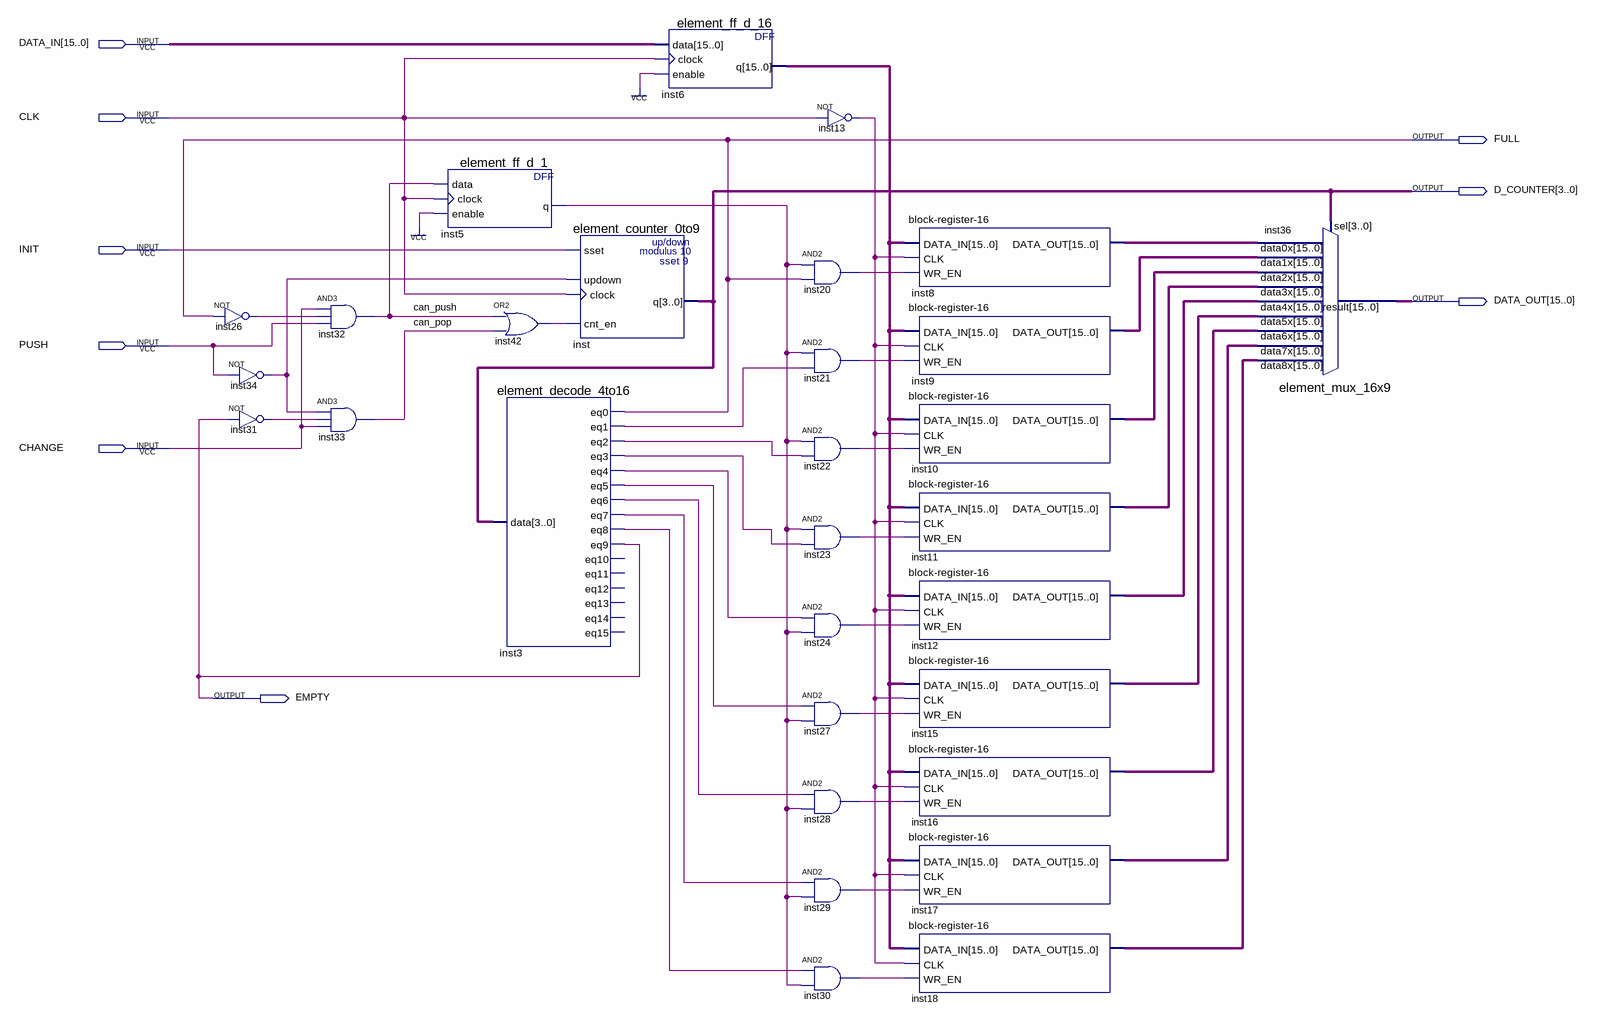
[diagram p0: schematic sheet]
// Quartus schematic block-stack.bdf as structural Verilog: 30 symbols, 9 pins
module \block-stack  (
  input  [15:0] DATA_IN,
  input  CLK,
  input  INIT,
  input  PUSH,
  input  CHANGE,
  output FULL,
  output [3:0] D_COUNTER,
  output [15:0] DATA_OUT,
  output EMPTY
);

  wire can_pop, can_push, inst3_eq1, inst3_eq2, inst3_eq3, inst3_eq4, inst3_eq5, inst3_eq6, inst3_eq7,
       inst3_eq8, inst5_q, inst13_out, inst20_out, inst21_out, inst22_out, inst23_out, inst24_out,
       inst26_out, inst27_out, inst28_out, inst29_out, inst30_out, inst31_out, inst34_out, inst42_out;
  wire [15:0] inst6_q, inst8_data_out, inst9_data_out, inst10_data_out, inst11_data_out, inst12_data_out,
       inst15_data_out, inst16_data_out, inst17_data_out, inst18_data_out;

  not inst26 (inst26_out, FULL);
  not inst34 (inst34_out, PUSH);
  not inst31 (inst31_out, EMPTY);
  and inst32 (can_push, CHANGE, inst26_out, PUSH);
  and inst33 (can_pop, inst34_out, inst31_out, CHANGE);
  element_ff_d_1 inst5 (.data(can_push), .clock(CLK), .enable(1'b1), .q(inst5_q));
  or inst42 (inst42_out, can_push, can_pop);
  element_decode_4to16 inst3 (
    .data(D_COUNTER), .eq0(FULL), .eq1(inst3_eq1), .eq2(inst3_eq2), .eq3(inst3_eq3), .eq4(inst3_eq4),
    .eq5(inst3_eq5), .eq6(inst3_eq6), .eq7(inst3_eq7), .eq8(inst3_eq8), .eq9(EMPTY));  // open: eq10, eq11, eq12, eq13, eq14, eq15
  element_counter_0to9 inst (.sset(INIT), .updown(inst34_out), .clock(CLK), .cnt_en(inst42_out), .q(D_COUNTER));
  element_ff_d_16 inst6 (.data(DATA_IN), .clock(CLK), .enable(1'b1), .q(inst6_q));
  not inst13 (inst13_out, CLK);
  and inst20 (inst20_out, inst5_q, FULL);
  and inst21 (inst21_out, inst5_q, inst3_eq1);
  and inst22 (inst22_out, inst5_q, inst3_eq2);
  and inst23 (inst23_out, inst5_q, inst3_eq3);
  and inst24 (inst24_out, inst3_eq4, inst5_q);
  and inst27 (inst27_out, inst3_eq5, inst5_q);
  and inst28 (inst28_out, inst3_eq6, inst5_q);
  and inst29 (inst29_out, inst3_eq7, inst5_q);
  and inst30 (inst30_out, inst3_eq8, inst5_q);
  \block-register-16  inst8 (.DATA_IN(inst6_q), .CLK(inst13_out), .WR_EN(inst20_out), .DATA_OUT(inst8_data_out));
  \block-register-16  inst9 (.DATA_IN(inst6_q), .CLK(inst13_out), .WR_EN(inst21_out), .DATA_OUT(inst9_data_out));
  \block-register-16  inst10 (.DATA_IN(inst6_q), .CLK(inst13_out), .WR_EN(inst22_out), .DATA_OUT(inst10_data_out));
  \block-register-16  inst11 (.DATA_IN(inst6_q), .CLK(inst13_out), .WR_EN(inst23_out), .DATA_OUT(inst11_data_out));
  \block-register-16  inst12 (.DATA_IN(inst6_q), .CLK(inst13_out), .WR_EN(inst24_out), .DATA_OUT(inst12_data_out));
  \block-register-16  inst15 (.DATA_IN(inst6_q), .CLK(inst13_out), .WR_EN(inst27_out), .DATA_OUT(inst15_data_out));
  \block-register-16  inst16 (.DATA_IN(inst6_q), .CLK(inst13_out), .WR_EN(inst28_out), .DATA_OUT(inst16_data_out));
  \block-register-16  inst17 (.DATA_IN(inst6_q), .CLK(inst13_out), .WR_EN(inst29_out), .DATA_OUT(inst17_data_out));
  \block-register-16  inst18 (.DATA_IN(inst6_q), .CLK(inst13_out), .WR_EN(inst30_out), .DATA_OUT(inst18_data_out));
  element_mux_16x9 inst36 (
    .data8x(inst18_data_out), .data7x(inst17_data_out), .data6x(inst16_data_out), .data5x(inst15_data_out),
    .data4x(inst12_data_out), .data3x(inst11_data_out), .data2x(inst10_data_out), .data1x(inst9_data_out),
    .data0x(inst8_data_out), .sel(D_COUNTER), .result(DATA_OUT));
endmodule
